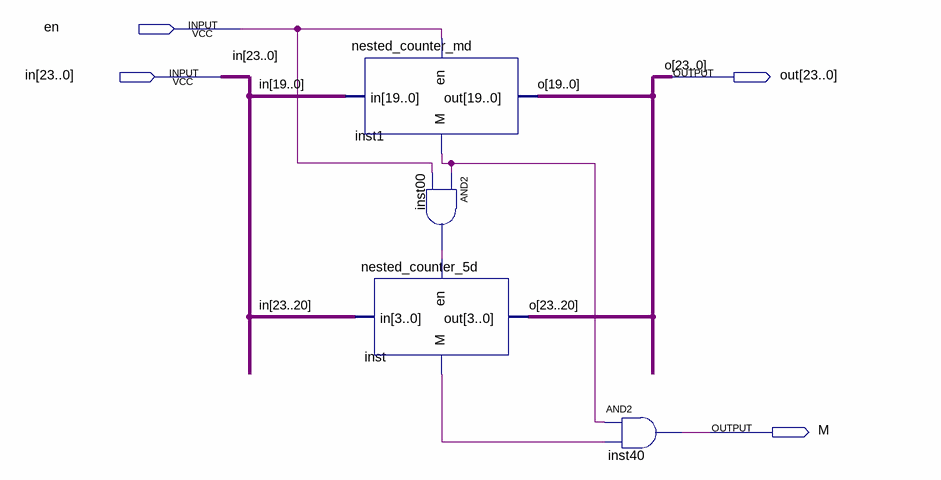
[diagram p0: schematic sheet]
// Quartus schematic nested_counter_5md.bdf as structural Verilog: 4 symbols, 4 pins
module nested_counter_5md (
  input  en,
  input  [23:0] in,
  output [23:0] out,
  output M
);

  wire inst00_out, inst1_m, inst_m;

  nested_counter_md inst1 (.en(en), .in(in[19:0]), .out(out[19:0]), .M(inst1_m));
  and inst00 (inst00_out, inst1_m, en);
  nested_counter_5d inst (.en(inst00_out), .in(in[23:20]), .out(out[23:20]), .M(inst_m));
  and inst40 (M, inst1_m, inst_m);

  // Other names for the same wires on the sheet: o[23:0] = out
endmodule
